# Altium schematic sheet SCH_BLOCK.SchDoc
size A; SheetNumber: 1; SheetTotal: 3
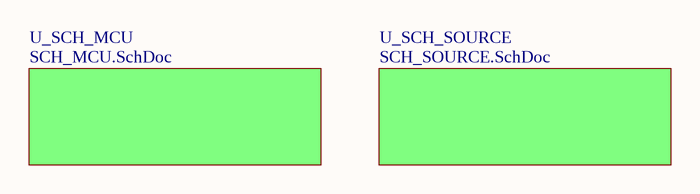
[diagram p0: SCH_BLOCK.SchDoc]

## Sub-sheets
U_SCH_MCU = SCH_MCU.SchDoc: no entries
U_SCH_SOURCE = SCH_SOURCE.SchDoc: no entries